# EasyEDA Pro project ProPrj_3x3motorFPGA_2025-06-28.epro, schematic 3x_motor_driver
Board Name: Board1; Create Date: 2025-06-04; Page Name: P1; Project Name: 3x3motorFPGA; Schematic Name: 3x_motor_driver; Update Date: 2025-06-21; Company: EasyEDA.com; Page Size: A4; Version: V2.0
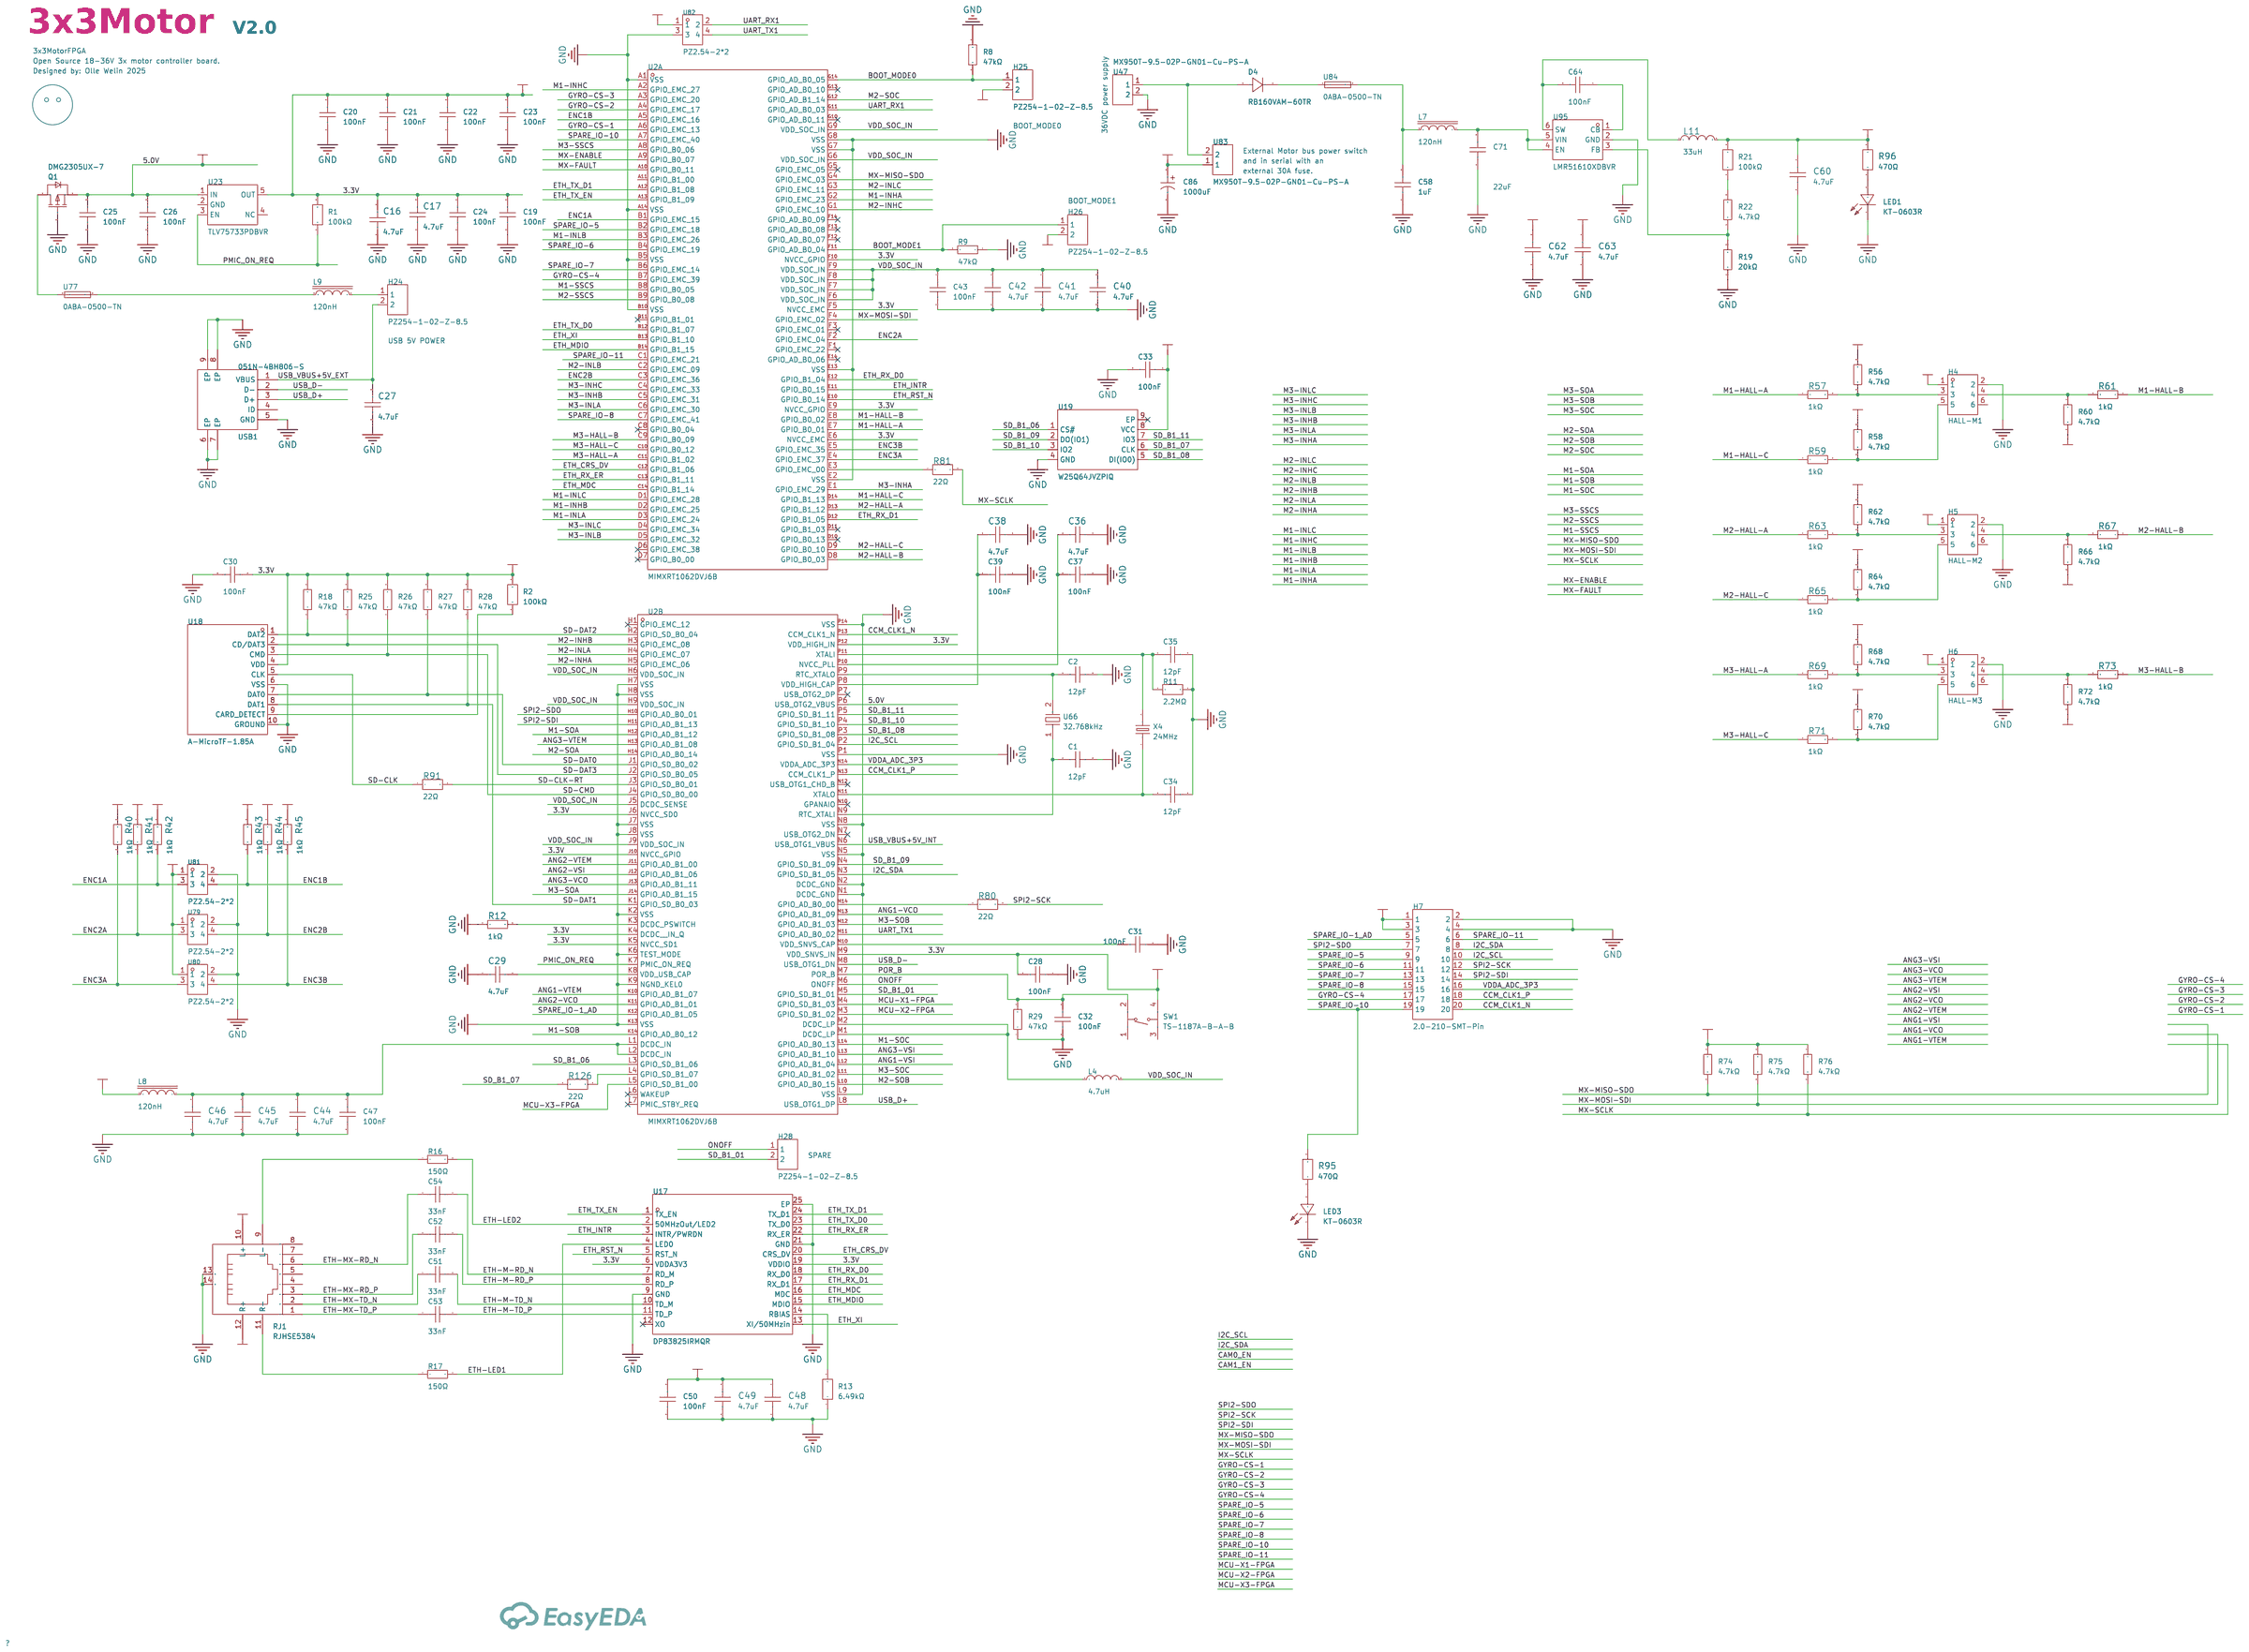
[diagram p0: schematic sheet]

## Parts
C1  12pF  [C0402]
C2  12pF  [C0402]
C16  4.7uF  [C0402]
C17  4.7uF  [C0402]
C19  100nF  [C0402]
C20  100nF  [C0402]
C21  100nF  [C0402]
C22  100nF  [C0402]
C23  100nF  [C0402]
C24  100nF  [C0402]
C25  100nF  [C0402]
C26  100nF  [C0402]
C27  4.7uF  [C0402]
C28  100nF  [C0402]
C29  4.7uF  [C0402]
C30  100nF  [C0402]
C31  100nF  [C0402]
C32  100nF  [C0402]
C33  100nF  [C0402]
C34  12pF  [C0402]
C35  12pF  [C0402]
C36  4.7uF  [C0402]
C37  100nF  [C0402]
C38  4.7uF  [C0402]
C39  100nF  [C0402]
C40  4.7uF  [C0402]
C41  4.7uF  [C0402]
C42  4.7uF  [C0402]
C43  100nF  [C0402]
C44  4.7uF  [C0402]
C45  4.7uF  [C0402]
C46  4.7uF  [C0402]
C47  100nF  [C0402]
C48  4.7uF  [C0402]
C49  4.7uF  [C0402]
C50  100nF  [C0402]
C51  33nF  [C0402]
C52  33nF  [C0402]
C53  33nF  [C0402]
C54  33nF  [C0402]
C58  1uF  [C1206]
C60  4.7uF  [C0402]
C62  4.7uF  [C0402]
C63  4.7uF  [C0402]
C64  100nF  [C0402]
C71  22uF  [C2220]
C86  1000uF  [CAP-TH_BD13.0-P5.00-D0.6-FD]
CBB1  -
CBB2  -
CBB3  -
D4  RB160VAM-60TR  [TUMD2M_L2.0-W1.4-LS2.5-RD]
H4  排母/2.54mm2x3直排母袋装环保  [HDR-TH_6P-P2.54-V-F-R2-C3-S2.54]
H5  排母/2.54mm2x3直排母袋装环保  [HDR-TH_6P-P2.54-V-F-R2-C3-S2.54]
H6  排母/2.54mm2x3直排母袋装环保  [HDR-TH_6P-P2.54-V-F-R2-C3-S2.54]
H7  2.0-210-SMT-Pin  [HDR-TH_20P-P2.00-V-F-R2-C10-S2.00]
H24  PZ254-1-02-Z-8.5  [HDR-TH_2P-P2.54-V-M]
H25  PZ254-1-02-Z-8.5  [HDR-TH_2P-P2.54-V-M]
H26  PZ254-1-02-Z-8.5  [HDR-TH_2P-P2.54-V-M]
H28  PZ254-1-02-Z-8.5  [HDR-TH_2P-P2.54-V-M]
L4  4.7uH  [IND-SMD_L4.0-W4.0]
L7  120nH  [IND-SMD_L2.9-W2.5]
L8  120nH  [IND-SMD_L2.9-W2.5]
L9  120nH  [IND-SMD_L2.9-W2.5]
L11  33uH  [IND-SMD_L8.0-W8.0]
LED1  KT-0603R  [LED0603-RD]
LED3  KT-0603R  [LED0603-RD]
Q1  DMG2305UX-7  [SOT-23-3_L2.9-W1.3-P1.90-LS2.4-BR]
R1  100kΩ  [R0402]
R2  100kΩ  [R0402]
R8  47kΩ  [R0402]
R9  47kΩ  [R0402]
R11  2.2MΩ  [R0402]
R12  1kΩ  [R0402]
R13  6.49kΩ  [R0402]
R16  150Ω  [R0402]
R17  150Ω  [R0402]
R18  47kΩ  [R0402]
R19  20kΩ  [R0402]
R21  100kΩ  [R0402]
R22  4.7kΩ  [R0402]
R25  47kΩ  [R0402]
R26  47kΩ  [R0402]
R27  47kΩ  [R0402]
R28  47kΩ  [R0402]
R29  47kΩ  [R0402]
R40  1kΩ  [R0402]
R41  1kΩ  [R0402]
R42  1kΩ  [R0402]
R43  1kΩ  [R0402]
R44  1kΩ  [R0402]
R45  1kΩ  [R0402]
R56  4.7kΩ  [R0402]
R57  1kΩ  [R0402]
R58  4.7kΩ  [R0402]
R59  1kΩ  [R0402]
R60  4.7kΩ  [R0402]
R61  1kΩ  [R0402]
R62  4.7kΩ  [R0402]
R63  1kΩ  [R0402]
R64  4.7kΩ  [R0402]
R65  1kΩ  [R0402]
R66  4.7kΩ  [R0402]
R67  1kΩ  [R0402]
R68  4.7kΩ  [R0402]
R69  1kΩ  [R0402]
R70  4.7kΩ  [R0402]
R71  1kΩ  [R0402]
R72  4.7kΩ  [R0402]
R73  1kΩ  [R0402]
R74  4.7kΩ  [R0402]
R75  4.7kΩ  [R0402]
R76  4.7kΩ  [R0402]
R80  22Ω  [R0402]
R81  22Ω  [R0402]
R91  22Ω  [R0402]
R95  470Ω  [R0402]
R96  470Ω  [R0402]
R126  22Ω  [R0402]
RJ1  RJHSE5384  [RJ45-TH_RJHSE5384]
SW1  TS-1187A-B-A-B  [SW-SMD_4P-L5.1-W5.1-P3.70-LS6.5-TL_H1.5]
U2  MIMXRT1062DVJ6B  [LFBGA-196_L12.0-W12.0-R14-C14-P0.80-BL]  (sections 1,2)
U17  DP83825IRMQR  [HVQFN-24_L3.0-W3.0-P0.40-TL-EP1.9]
U18  A-MicroTF-1.85A  [TF-SMD_A-MICROTF-1.85A]
U19  W25Q64JVZPIQ  [WSON-8_L6.0-W5.0-P1.27-BL-EP]
U23  TLV75733PDBVR  [SOT-23-5_L2.9-W1.6-P0.95-LS2.8-BL]
U47  MX950T-9.5-02P-GN01-Cu-PS-A  [CONN-TH_2P-P9.50_DB910-9.52-2P]
U66  32.768kHz  [CRYSTAL-SMD_L3.2-W1.5-2]
U77  0ABA-0500-TN  [F0402]
U79  PZ2.54-2*2  [HDR-TH_4P-P2.54-V-M-R2-C2-S2.54]
U80  PZ2.54-2*2  [HDR-TH_4P-P2.54-V-M-R2-C2-S2.54]
U81  PZ2.54-2*2  [HDR-TH_4P-P2.54-V-M-R2-C2-S2.54]
U82  PZ2.54-2*2  [HDR-TH_4P-P2.54-V-M-R2-C2-S2.54]
U83  MX950T-9.5-02P-GN01-Cu-PS-A  [CONN-TH_2P-P9.50_DB910-9.52-2P]
U84  0ABA-0500-TN  [F0402]
U95  LMR51610XDBVR  [SOT-23-6_L2.9-W1.6-P0.95-LS2.8-BR]
USB1  051N-4BH806-S  [MICRO-USB-SMD_051N-4BH806-S]
X4  24MHz  [OSC-SMD_L5.0-W3.2]

## Library data of the parts
C1 C2 C34 C35 = V120J0402HQC500NBT: Capacitance:12pF Voltage Rating:50V Temperature Coefficient:C0G; LCSC Part Name: ±5pF 12pF 50V; Supplier Part: C5251212; Manufacturer: VIIYONG(微容); Supplier Footprint: 0402; JLCPCB Part Class: Extended Part; Datasheet: https://atta.szlcsc.com/upload/public/pdf/source/20210621/C2841456_D184B2C3CE76695828CADF567D00C122.pdf; Supplier: LCSC; Voltage Rating: 50V; Temperature Coefficient: C0G; Check: true
C16 C17 C27 C29 C36 C38 C40-C42 C44-C46 C48 C49 C60 C62 C63 = LMK105BBJ475MVLF: Capacitance: Tolerance:±20% Tolerance:±20% Voltage Rated: Temperature Coefficient:; LCSC Part Name: 4.7uF ±20% 10V; Supplier Part: C386043; Manufacturer: TAIYO YUDEN(太诱); Supplier Footprint: 0402; JLCPCB Part Class: Extended Part; Datasheet: https://atta.szlcsc.com/upload/public/pdf/source/20210525/C2802164_C0429B055888A674C3F00BA74B841C5B.pdf; Supplier: LCSC; Tolerance: ±20%; Check: true
C19-C26 C28 C30-C33 C37 C39 C43 C47 C50 C64 = CL05B104KB54PNC: Capacitance: Tolerance:±10% Tolerance:±10% Voltage Rated: Temperature Coefficient:; LCSC Part Name: 100nF ±10% 50V; Supplier Part: C307331; Manufacturer: SAMSUNG(三星); Supplier Footprint: 0402; JLCPCB Part Class: Basic Part; Datasheet: https://atta.szlcsc.com/upload/public/pdf/source/20160218/1457707763339.pdf; Supplier: LCSC; Tolerance: ±10%; Check: true
C51-C54 = 0402B333K160CT: Capacitance: Tolerance:±10% Tolerance:±10% Voltage Rated: Temperature Coefficient:; LCSC Part Name: 33nF ±10% 16V; Supplier Part: C301939; Manufacturer: Walsin(华新科); Supplier Footprint: 0402; JLCPCB Part Class: Extended Part; Datasheet: https://atta.szlcsc.com/upload/public/pdf/source/20191217/C469650_84AD5C6F618CF4AC0C6D987F2E8FE6F8.pdf; Supplier: LCSC; Tolerance: ±10%; Check: true
C58 = CL31B105KBHNNNE: Capacitance: Tolerance:±10% Tolerance:±10% Voltage Rated: Temperature Coefficient:; LCSC Part Name: 1uF ±10% 50V; Supplier Part: C1848; Manufacturer: SAMSUNG(三星); Supplier Footprint: 1206; JLCPCB Part Class: Basic Part; Datasheet: https://atta.szlcsc.com/upload/public/pdf/source/20160218/1457707763339.pdf; Supplier: LCSC; Tolerance: ±10%; Check: true
C71 = FS55X226K500EHG: Capacitance:22uF Tolerance:±10% Tolerance:±10% Voltage Rating:50V Temperature Coefficient:X7R; LCSC Part Name: 22uF ±10% 50V; Supplier Part: C784103; Manufacturer: PSA(信昌电陶); Supplier Footprint: 2220; JLCPCB Part Class: Extended Part; Datasheet: https://atta.szlcsc.com/upload/public/pdf/source/20190723/C381466_B1CCDB289216E7EE775C98769E222CFD.pdf; Supplier: LCSC; Tolerance: ±10%; Voltage Rating: 50V; Temperature Coefficient: X7R; Check: true
C86 = 50V1000uF CD288: Capacitance: Tolerance:±20% Tolerance:±20% Rated Voltage: Ripple Current:- Equivalent Series Resistance(ESR):- Lead Spacing: φD: L: Lifetime @ Temp:- Operating Temperature:-40℃~+105℃ Operating Temperature:-40℃~+105℃; LCSC Part Name: 1000uF ±20% 50V; Supplier Part: C2960425; Manufacturer: HRK(鸿瑞凯电子); Supplier Footprint: 插件,D13xL26mm; JLCPCB Part Class: Extended Part; Datasheet: https://atta.szlcsc.com/upload/public/pdf/source/20220228/DED310EF63E6FF368A764400E9E39D2D.pdf; Supplier: LCSC; Tolerance: ±20%; Operating Temperature: -40℃~+105℃
D4 = RB160VAM-60TR: Diode Configuration:Independent Type Voltage - Forward(Vf@If):610mV@1A Voltage - DC Reverse(Vr):60V Current - Rectified:1A Reverse Leakage Current (Ir):40uA@60V; LCSC Part Name: 电压:60V 电流:1A; Supplier Part: C600653; Manufacturer: ROHM(罗姆); Supplier Footprint: SOD-323HE; JLCPCB Part Class: Extended Part; Datasheet: https://atta.szlcsc.com/upload/public/pdf/source/20210312/C600653_2327DECE823B494B59F4354F32032AFC.pdf; Supplier: LCSC; Diode Configuration: Independent Type; Voltage - Forward(Vf@If): 610mV@1A; Voltage - DC Reverse(Vr): 60V; Current - Rectified: 1A; Reverse Leakage Current (Ir): 40uA@60V
H4-H6 = 排母/2.54mm2x3直排母袋装环保: Circluar Pins/Square Pins:- Current Rating (Max):- Voltage Rating (Max):- Length of Mating Pin:- Insulation Height:- Contact Material:; LCSC Part Name: 2.54mm 2x3 直排母 袋装 环保; Supplier Part: C47552; Supplier Footprint: 2.54mm2x3; JLCPCB Part Class: Extended Part; Supplier: LCSC
H7 = 2.0-210-SMT-Pin: Supplier Part: C9900188734; Supplier Footprint: TH_2X10P; JLCPCB Part Class: Extended Part; Supplier: LCSC
H24-H26 H28 = PZ254-1-02-Z-8.5_C2894925: Pin Structure:1x2P Pitch:2.54mm Row Spacing:- Circluar Pins/Square Pins:Policy Mounting Type:Straight Number of Rows:Single Row Number of Pins:2P Current Rating:3A Voltage Rating (Max):- Length of Mating Pin:6mm Insulation Height:2.5mm Length of End Conne; LCSC Part Name: 1x2P 间距:2.54mm 方针 直插; Supplier Part: C2894925; Manufacturer: HCTL(华灿天禄); Supplier Footprint: 插件,P=2.54mm; JLCPCB Part Class: Extended Part; Datasheet: https://atta.szlcsc.com/upload/public/pdf/source/20240305/0F0A2A5C422E5D195558C9C26715A031.pdf; Supplier: LCSC; Pin Structure: 1x2P; Pitch: 2.54mm; Circluar Pins/Square Pins: Policy; Mounting Type: Straight; Number of Rows: Single Row; Number of Pins: 2P; Current Rating: 3A; Length of Mating Pin: 6mm; Insulation Height: 2.5mm; Length of End Connection Pin: 3mm; Contact Material: Brass; Operating Temperature: -40℃~+105℃; Color: Black
L4 = SNR4018-4R7MT: Inductance:4.7uH Tolerance:±20% Tolerance:±20% Current - Saturation(Isat):1.7A DC Resistance(DCR):115mΩ Type:Shielded inductor; LCSC Part Name: 4.7uH ±20% 1.7A 温升电流：1.2A; Supplier Part: C5127371; Manufacturer: LanTu Micro(蓝图微电); Supplier Footprint: SMD,4x4mm; JLCPCB Part Class: Extended Part; Datasheet: https://atta.szlcsc.com/upload/public/pdf/source/20220824/1D4634DBF555B7A8AAFB4C498854329B.pdf; Supplier: LCSC; Tolerance: ±20%; Current - Saturation(Isat): 1.7A; DC Resistance(DCR): 115mΩ; Type: Shielded inductor; Check: true
L7-L9 = LSF1008-R12J-T: Inductance: Tolerance:±5% Tolerance:±5% Rated Current: DC Resistance (DCR):; LCSC Part Name: 120nH ±5%; Supplier Part: C252036; Manufacturer: EMTEK(兆欣); Supplier Footprint: 1008; JLCPCB Part Class: Extended Part; Datasheet: https://atta.szlcsc.com/upload/public/pdf/source/20180820/C252039_93C7C0847C63F47FE7E3FF4F1F6863C7.pdf; Supplier: LCSC; Tolerance: ±5%
L11 = NRS8030T330MJGJ: Inductance: Tolerance:±20% Tolerance:±20% Rated Current: Saturation Current (Isat):1.3A DC Resistance (DCR): Type:- Ratings:-; LCSC Part Name: 33uH ±20% 1.3A; Supplier Part: C223028; Manufacturer: TAIYO YUDEN(太诱); Supplier Footprint: SMD; JLCPCB Part Class: Extended Part; Datasheet: https://atta.szlcsc.com/upload/public/pdf/source/20190109/C223107_6890E0091A0A1C9F55D0D2B3B6121437.pdf; Supplier: LCSC; Tolerance: ±20%; Saturation Current (Isat): 1.3A
LED1 LED3 = KT-0603R: Emitted Color:Red Power Dissipation:- Forward Current:- Dominant Wavelength:- Dominant Wavelength:- Peak Wavelength:- Diode Configuration:- Lens Color:- Color Temperature:- Color Temperature:- Viewing Angle:- Mounting Sytle:- Operating Temperature:-40℃~+8; LCSC Part Name: 0603 红灯 高亮; Supplier Part: C2286; Manufacturer: KENTO; Supplier Footprint: 0603; JLCPCB Part Class: Basic Part; Datasheet: https://atta.szlcsc.com/upload/public/pdf/source/20160616/1466072038404.pdf; Supplier: LCSC; Emitted Color: Red; Operating Temperature: -40℃~+85℃
Q1 = DMG2305UX-7_C5261054: Type:1 piece P-channel Drain to Source Voltage:20V Current - Continuous Drain(Id):5A RDS(on):45mΩ@4.5V,3.4A Pd - Power Dissipation:1.31W Gate Threshold Voltage (Vgs(th)@Id):400mV Gate Charge(Qg):14.3nC@4.5V Input Capacitance(Ciss@Vds):1.2nF@15V Reverse Tr; LCSC Part Name: 1个P沟道 耐压:20V 电流:5A; Supplier Part: C5261054; Manufacturer: HXY MOSFET(华轩阳电子); Supplier Footprint: SOT-23; JLCPCB Part Class: Extended Part; Datasheet: https://atta.szlcsc.com/upload/public/pdf/source/20221111/024C642DF6D3CB691005FFB8AA66D2BE.pdf; Supplier: LCSC; Type: 1 piece P-channel; Drain to Source Voltage: 20V; Current - Continuous Drain(Id): 5A; RDS(on): 45mΩ@4.5V,3.4A; Pd - Power Dissipation: 1.31W; Gate Threshold Voltage (Vgs(th)@Id): 400mV; Gate Charge(Qg): 14.3nC@4.5V; Input Capacitance(Ciss@Vds): 1.2nF@15V; Reverse Transfer Capacitance (Crss@Vds): 151pF@15V; Operating Temperature: -55℃~+150℃; Check: true
R1 R2 R21 = FRC0402F1003TS: Type:Thick Film Resistors Resistance:100kΩ Tolerance:±1% Tolerance:±1% Power(Watts): Overload Voltage (Max): Temperature Coefficient:±100ppm/℃ Temperature Coefficient:±100ppm/℃ Operating Temperature Range:-55℃~+155℃ Operating Temperature Range:-55℃~+155℃; LCSC Part Name: 100kΩ ±1% 62.5mW 厚膜电阻; Supplier Part: C2906859; Manufacturer: FOJAN(富捷); Supplier Footprint: 0402; JLCPCB Part Class: Extended Part; Datasheet: https://atta.szlcsc.com/upload/public/pdf/source/20211221/925EC7D7225764EE0046F22065062C87.pdf; Supplier: LCSC; Type: Thick Film Resistors; Tolerance: ±1%; Temperature Coefficient: ±100ppm/℃; Operating Temperature Range: -55℃~+155℃; Check: true
R8 R9 R18 R25-R29 = AC0402JR-0747KL: Type:Thick Film Resistors Resistance: Tolerance:±5% Tolerance:±5% Power(Watts): Overload Voltage (Max): Temperature Coefficient:±100ppm/℃ Temperature Coefficient:±100ppm/℃ Operating Temperature Range:-55℃~+155℃ Operating Temperature Range:-55℃~+155℃; LCSC Part Name: 厚膜电阻 47kΩ ±5% 62.5mW; Supplier Part: C144710; Manufacturer: YAGEO(国巨); Supplier Footprint: 0402; JLCPCB Part Class: Extended Part; Datasheet: https://atta.szlcsc.com/upload/public/pdf/source/20180927/C229861_4ABDC471507C1ED6AFB4BA66AFC8620A.pdf; Supplier: LCSC; Type: Thick Film Resistors; Tolerance: ±5%; Temperature Coefficient: ±100ppm/℃; Operating Temperature Range: -55℃~+155℃; Check: true
R11 = FRC0402F2204TS: Type:Thick Film Resistors Resistance:2.2MΩ Tolerance:±1% Tolerance:±1% Power(Watts):1/16W Voltage-Supply(Max):50V Temperature Coefficient:±100ppm/℃ Temperature Coefficient:±100ppm/℃ Operating Temperature:-55℃~+155℃ Operating Temperature:-55℃~+155℃; LCSC Part Name: 2.2MΩ ±1% 62.5mW 厚膜电阻; Supplier Part: C2998080; Manufacturer: FOJAN(富捷); Supplier Footprint: 0402; JLCPCB Part Class: Extended Part; Datasheet: https://atta.szlcsc.com/upload/public/pdf/source/20211221/925EC7D7225764EE0046F22065062C87.pdf; Supplier: LCSC; Type: Thick Film Resistors; Tolerance: ±1%; Power(Watts): 1/16W; Voltage-Supply(Max): 50V; Temperature Coefficient: ±100ppm/℃; Operating Temperature: -55℃~+155℃; Check: true
R12 R40-R45 R57 R59 R61 R63 R65 R67 R69 R71 R73 = 0402WGF1001TCE: Type:Thick Film Resistors Resistance:1kΩ Tolerance:±1% Tolerance:±1% Power(Watts): Overload Voltage (Max): Temperature Coefficient:±100ppm/℃ Temperature Coefficient:±100ppm/℃ Operating Temperature Range:-55℃~+155℃ Operating Temperature Range:-55℃~+155℃; LCSC Part Name: 1kΩ ±1% 62.5mW 厚膜电阻; Supplier Part: C11702; Manufacturer: UNI-ROYAL(厚声); Supplier Footprint: 0402; JLCPCB Part Class: Basic Part; Datasheet: https://atta.szlcsc.com/upload/public/pdf/source/20200306/C422600_1E6D84923E4A46A82E41ADD87F860B5C.pdf; Supplier: LCSC; Type: Thick Film Resistors; Tolerance: ±1%; Temperature Coefficient: ±100ppm/℃; Operating Temperature Range: -55℃~+155℃; Check: true
R13 = RT0402BRE076K49L: Type:Thin Film Resistor Resistance: Tolerance:±0.1% Tolerance:±0.1% Power(Watts): Temperature Coefficient:±50ppm/℃ Temperature Coefficient:±50ppm/℃ Operating Temperature Range:-55℃~+155℃ Operating Temperature Range:-55℃~+155℃; LCSC Part Name: 薄膜电阻 6.49kΩ ±0.1% 62.5mW; Supplier Part: C853380; Manufacturer: YAGEO(国巨); Supplier Footprint: 0402; JLCPCB Part Class: Extended Part; Datasheet: https://atta.szlcsc.com/upload/public/pdf/source/20200610/C326738_5639A9F1B6EB6E4AE2197577D3456E7F.pdf; Supplier: LCSC; Type: Thin Film Resistor; Tolerance: ±0.1%; Temperature Coefficient: ±50ppm/℃; Operating Temperature Range: -55℃~+155℃; Check: true
R16 R17 = 0402WGF1500TCE: Type:Thick Film Resistors Resistance: Tolerance:±1% Tolerance:±1% Power(Watts): Overload Voltage (Max): Temperature Coefficient:±100ppm/℃ Temperature Coefficient:±100ppm/℃ Operating Temperature Range:-55℃~+155℃ Operating Temperature Range:-55℃~+155℃; LCSC Part Name: 150Ω ±1% 62.5mW 厚膜电阻; Supplier Part: C25082; Manufacturer: UNI-ROYAL(厚声); Supplier Footprint: 0402; JLCPCB Part Class: Extended Part; Datasheet: https://atta.szlcsc.com/upload/public/pdf/source/20200306/C422600_1E6D84923E4A46A82E41ADD87F860B5C.pdf; Supplier: LCSC; Type: Thick Film Resistors; Tolerance: ±1%; Temperature Coefficient: ±100ppm/℃; Operating Temperature Range: -55℃~+155℃; Check: true
R19 = 0402WGJ0203TCE: Type:Thick Film Resistors Resistance:20kΩ Tolerance:±5% Tolerance:±5% Power(Watts): Overload Voltage (Max): Temperature Coefficient:±100ppm/℃ Temperature Coefficient:±100ppm/℃ Operating Temperature Range:-55℃~+155℃ Operating Temperature Range:-55℃~+155℃; LCSC Part Name: 20kΩ ±5% 62.5mW 厚膜电阻; Supplier Part: C25545; Manufacturer: UNI-ROYAL(厚声); Supplier Footprint: 0402; JLCPCB Part Class: Extended Part; Datasheet: https://atta.szlcsc.com/upload/public/pdf/source/20200306/C422600_1E6D84923E4A46A82E41ADD87F860B5C.pdf; Supplier: LCSC; Type: Thick Film Resistors; Tolerance: ±5%; Temperature Coefficient: ±100ppm/℃; Operating Temperature Range: -55℃~+155℃; Check: true
R22 R56 R58 R60 R62 R64 R66 R68 R70 R72 R74-R76 = 0402WGF4701TCE: Type:Thick Film Resistors Resistance:4.7kΩ Tolerance:±1% Tolerance:±1% Power(Watts): Overload Voltage (Max): Temperature Coefficient:±100ppm/℃ Temperature Coefficient:±100ppm/℃ Operating Temperature Range:-55℃~+155℃ Operating Temperature Range:-55℃~+155℃; LCSC Part Name: 4.7kΩ ±1% 62.5mW 厚膜电阻; Supplier Part: C25900; Manufacturer: UNI-ROYAL(厚声); Supplier Footprint: 0402; JLCPCB Part Class: Basic Part; Datasheet: https://atta.szlcsc.com/upload/public/pdf/source/20200306/C422600_1E6D84923E4A46A82E41ADD87F860B5C.pdf; Supplier: LCSC; Type: Thick Film Resistors; Tolerance: ±1%; Temperature Coefficient: ±100ppm/℃; Operating Temperature Range: -55℃~+155℃
R80 R81 R91 R126 = ERJU02J220X: Type:Thick Film Resistors Resistance: Tolerance:±5% Tolerance:±5% Power(Watts): Overload Voltage (Max):- Temperature Coefficient:±200ppm/℃ Temperature Coefficient:±200ppm/℃ Operating Temperature Range:-55℃~+155℃ Operating Temperature Range:-55℃~+155℃; LCSC Part Name: 22Ω ±5% 100mW 厚膜电阻; Supplier Part: C417075; Manufacturer: PANASONIC(松下); Supplier Footprint: 0402; JLCPCB Part Class: Extended Part; Datasheet: https://atta.szlcsc.com/upload/public/pdf/source/20190902/C417075_4E42CA60D5BEE932868E62293D93DA2D.pdf; Supplier: LCSC; Type: Thick Film Resistors; Tolerance: ±5%; Temperature Coefficient: ±200ppm/℃; Operating Temperature Range: -55℃~+155℃
R95 R96 = 0402WGF4700TCE: Type:Thick Film Resistors Resistance: Tolerance:±1% Tolerance:±1% Power(Watts): Overload Voltage (Max): Temperature Coefficient:±100ppm/℃ Temperature Coefficient:±100ppm/℃ Operating Temperature Range:-55℃~+155℃ Operating Temperature Range:-55℃~+155℃; LCSC Part Name: 470Ω ±1% 62.5mW 厚膜电阻; Supplier Part: C25117; Manufacturer: UNI-ROYAL(厚声); Supplier Footprint: 0402; JLCPCB Part Class: Basic Part; Datasheet: https://atta.szlcsc.com/upload/public/pdf/source/20200306/C422600_1E6D84923E4A46A82E41ADD87F860B5C.pdf; Supplier: LCSC; Type: Thick Film Resistors; Tolerance: ±1%; Temperature Coefficient: ±100ppm/℃; Operating Temperature Range: -55℃~+155℃
RJ1 = RJHSE5384: Connector Type:RJ45Receptacle Number of Ports:1 Mounting Style:Right-Angle Shielding:有屏蔽 LED:WithLED Ratings:- Contact Material:Phosphor bronze Contact Plating:Gold Operating Temperature Range:-55℃~+85℃ Operating Temperature Range:-55℃~+85℃; LCSC Part Name: 弯插 带LED; Supplier Part: C464587; Manufacturer: Amphenol; Supplier Footprint: 插件; JLCPCB Part Class: Extended Part; Datasheet: https://atta.szlcsc.com/upload/public/pdf/source/20200113/C464587_DA37165506181FE3475508D68C93AFC6.pdf; Supplier: LCSC; Connector Type: RJ45Receptacle; Number of Ports: 1; Mounting Style: Right-Angle; Shielding: 有屏蔽; LED: WithLED; Contact Material: Phosphor bronze; Contact Plating: Gold; Operating Temperature Range: -55℃~+85℃
SW1 = TS-1187A-B-A-B: Circuit:SPST Actuator Style:Round Button Operating Force:160gf Mounting Style:Brick nogging Switch Length:5.1mm Switch Width:5.1mm Switch Height:1.5mm Strike Gundam:不带 Contact Current:50mA Voltage Rating (DC):12V Insulation Resistance:- Actuator/Cap Color; LCSC Part Name: 5.1*5.1*1.5mm 立贴 轻触开关; Supplier Part: C318884; Manufacturer: XKB Connectivity(中国星坤); Supplier Footprint: SMD; JLCPCB Part Class: Basic Part; Datasheet: https://atta.szlcsc.com/upload/public/pdf/source/20200227/C318890_053E50208A88A7BA1965D8746000774E.pdf; Supplier: LCSC; Circuit: SPST; Actuator Style: Round Button; Operating Force: 160gf; Mounting Style: Brick nogging; Switch Length: 5.1mm; Switch Width: 5.1mm; Switch Height: 1.5mm; Strike Gundam: 不带; Contact Current: 50mA; Voltage Rating (DC): 12V; Actuator/Cap Color: 金色; With Lamp: No; Mechanical Life: 10万次; Operating Temperature: -30℃~+85℃; Check: true
U2 = MIMXRT1062DVJ6B: CPU Core:- GPIO Ports Number:127 Operating Voltage Range:3V~3.6V Operating Voltage Range:3V~3.6V CPU Maximum Speed:600MHz Operating Temperature Range:0℃~+95℃ Operating Temperature Range:0℃~+95℃ ADC (Bit):12bit Universal Serial Bus:Yes Watchdog:Yes Low-Vol; Supplier Part: C3216699; Manufacturer: NXP(恩智浦); Supplier Footprint: LFBGA-196; JLCPCB Part Class: Extended Part; Datasheet: https://www.nxp.com.cn/docs/en/data-sheet/IMXRT1060XXEC.pdf; Supplier: LCSC; GPIO Ports Number: 127; Operating Voltage Range: 3V~3.6V; CPU Maximum Speed: 600MHz; Operating Temperature Range: 0℃~+95℃; ADC (Bit): 12bit; Universal Serial Bus: Yes; Watchdog: Yes; Low-Voltage Detect: Yes; Secure Digital Input and Output: Yes; Direct Memory Access: Yes
U17 = DP83825IRMQR: Application Function: Number of Channels: Interface: Supply Voltage:1.8V；3.3V Supply Voltage:1.8V；3.3V Supply Current:15.5mA Operating Temperature:-40℃~+85℃ Operating Temperature:-40℃~+85℃; LCSC Part Name: DP83825I低功耗10/100Mbps以太网物理层收发器; Supplier Part: C783599; Manufacturer: TI(德州仪器); Supplier Footprint: HVQFN-24-EP(3x3); JLCPCB Part Class: Extended Part; Datasheet: https://www.ti.com/cn/lit/gpn/dp83825i; Supplier: LCSC; Supply Voltage: 1.8V；3.3V; Supply Current: 15.5mA; Operating Temperature: -40℃~+85℃; Check: true
U18 = A-MicroTF-1.85A: Card Connection Mode:Self-bouncing Card Type:MicroSD card (TF card) Connector Type:Card Slot Additional Card Detection Pins:- Supplementary Features:- Maximum Body Height:1.85mm Operating Temperature Range:-25℃~+85℃ Operating Temperature Range:-25℃~+85℃; LCSC Part Name: 自弹式 MicroSD卡(TF卡) 卡座; Supplier Part: C22467599; Manufacturer: MyAntenna(摩天射频); Supplier Footprint: SMD; JLCPCB Part Class: Extended Part; Datasheet: https://atta.szlcsc.com/upload/public/pdf/source/20240625/953FC7A55E22CF141735372468CF4E69.pdf; Supplier: LCSC; Card Connection Mode: Self-bouncing; Card Type: MicroSD card (TF card); Connector Type: Card Slot; Maximum Body Height: 1.85mm; Operating Temperature Range: -25℃~+85℃; Check: true
U19 = W25Q64JVZPIQ: Interface Type:SPI Memory Size:64Mbit Clock Frequency (fc):133MHz Supply Voltage:2.7V~3.6V Supply Voltage:2.7V~3.6V Page Programming Time (Tpp):400us Block Erase Time (tBE):120ms@(32KB) Data Retention - TDR (Year):20 years Operating Temperature:-40℃~+85℃; Supplier Part: C2940197; Manufacturer: WINBOND(华邦); Supplier Footprint: WSON-8-EP(5x6); JLCPCB Part Class: Extended Part; Datasheet: https://atta.szlcsc.com/upload/public/pdf/source/20220111/96C134BA110DAC08742B3CB6C4519B4C.pdf; Supplier: LCSC; Interface Type: SPI; Memory Size: 64Mbit; Clock Frequency (fc): 133MHz; Supply Voltage: 2.7V~3.6V; Page Programming Time (Tpp): 400us; Block Erase Time (tBE): 120ms@(32KB); Data Retention - TDR (Year): 20 years; Operating Temperature: -40℃~+85℃; Check: true
U23 = TLV75733PDBVR: Output Type:Fixed Maximum Input Voltage:5.5V Output Voltage:3.3V Output Voltage:3.3V Output Current:1A Power Supply Rejection Ratio (PSRR):52dB Dropout Voltage:475mV@(1A) Feature:ESD Protection；Surge Protection；Low ESR；Thermal Protection(TSD)；Under-voltag; LCSC Part Name: 具有使能功能的 1A、低 IQ、高精度、低压降稳压器; Supplier Part: C485517; Manufacturer: TI(德州仪器); Supplier Footprint: SOT-23-5; JLCPCB Part Class: Extended Part; Datasheet: https://www.ti.com/cn/lit/gpn/tlv757p; Supplier: LCSC; Output Type: Fixed; Maximum Input Voltage: 5.5V; Output Voltage: 3.3V; Output Current: 1A; Power Supply Rejection Ratio (PSRR): 52dB; Dropout Voltage: 475mV@(1A); Feature: ESD Protection；Surge Protection；Low ESR；Thermal Protection(TSD)；Under-voltage Lockout；Overcurrent Protection(OCP)；With ability; Operating Temperature: -40℃~+125℃@(Tj); Output Polarity: Positive electrode; Number of Outputs: 1; Check: true
U47 U83 = MX950T-9.5-02P-GN01-Cu-PS-A: Number of Positions or Pins:1x2P Pitch:9.5mm Color:Green Mounting Type:Direct Insert Number of Pins:2P Number of Rows:1 Number of PINs Per Row:2 Screw Specification:M3 Current Rating:30A Voltage Rating (Max):300V Wire Gauge - AWG:10~26 Wire Gauge - AWG:10; LCSC Part Name: 1x2P 9.5mm 直插 排数:1 每排P数:2; Supplier Part: C5188495; Manufacturer: MAX(迈旭); Supplier Footprint: 插件,P=9.5mm; JLCPCB Part Class: Extended Part; Datasheet: https://atta.szlcsc.com/upload/public/pdf/source/20230914/A46700B75FD416133173DB44AA766FB2.pdf; Supplier: LCSC; Number of Positions or Pins: 1x2P; Pitch: 9.5mm; Color: Green; Mounting Type: Direct Insert; Number of Pins: 2P; Number of Rows: 1; Number of PINs Per Row: 2; Screw Specification: M3; Current Rating: 30A; Voltage Rating (Max): 300V; Wire Gauge - AWG: 10~26; Wire Gauge - mm2: 4; Operating Temperature: -40℃~+105℃; Check: true
U66 = H3100327092070CY: Crystal Type:- Frequency: Normal temperature Frequency Tolerance:±20ppm Normal temperature Frequency Tolerance:±20ppm External load capacitor: Frequency Stability(Full temperature range):- Frequency Stability(Full temperature range):- Equivalent Series Re; LCSC Part Name: 32.768kHz ±20ppm 9pF; Supplier Part: C20625736; Manufacturer: JGHC(晶光华); Supplier Footprint: SMD3215-2P; JLCPCB Part Class: Extended Part; Datasheet: https://atta.szlcsc.com/upload/public/pdf/source/20240227/1BA8F2B3CA37474D46EE46FE051746E1.pdf; Supplier: LCSC; Normal temperature Frequency Tolerance: ±20ppm; Equivalent Series Resistance (ESR): 70kΩ; Check: true
U77 U84 = 0ABA-0500-TN: Type:- Current Rating:500mA Voltage Rating (DC):32V Operating Temperature:-55℃~+125℃ Operating Temperature:-55℃~+125℃ Breaking Capacity:35A; Supplier Part: C3162379; Manufacturer: belfuse; Supplier Footprint: 0402; JLCPCB Part Class: Extended Part; Datasheet: https://atta.szlcsc.com/upload/public/pdf/source/20240129/EFB68109F57EF58AE31C262C6E681BC9.pdf; Supplier: LCSC; Current Rating: 500mA; Voltage Rating (DC): 32V; Operating Temperature: -55℃~+125℃; Breaking Capacity: 35A
U79-U82 = PZ2.54-2*2: Pin Structure:2x2P Pitch:2.54mm Number of Rows:双排 Number of Pins:4P; Supplier Part: C5156675; Manufacturer: ZHOURI(洲日); Supplier Footprint: 插件,P=2.54mm; JLCPCB Part Class: Extended Part; Datasheet: https://atta.szlcsc.com/upload/public/pdf/source/20220923/B99F04FBBE53F9D60C18D50D8418B40E.pdf; Supplier: LCSC; Pin Structure: 2x2P; Pitch: 2.54mm; Number of Rows: 双排; Number of Pins: 4P
U95 = LMR51610XDBVR: Function:Step-down type Output Type:Adjustable Input Voltage:4V~65V Input Voltage:4V~65V Output Voltage:- Output Voltage:- Output Current:1A Switching Frequency:400kHz~1.1MHz Switching Frequency:400kHz~1.1MHz Operating Temperature:-40℃~+150℃ Operating Tem; LCSC Part Name: 4V至65V输入范围的1A同步降压转换器; Supplier Part: C20539658; Manufacturer: TI(德州仪器); Supplier Footprint: SOT-23; JLCPCB Part Class: Extended Part; Datasheet: https://atta.szlcsc.com/upload/public/pdf/source/20240112/FA5D53F5D264F9958129C86E08D1F3BB.pdf; Supplier: LCSC; Function: Step-down type; Output Type: Adjustable; Input Voltage: 4V~65V; Output Current: 1A; Switching Frequency: 400kHz~1.1MHz; Operating Temperature: -40℃~+150℃; Synchronous Rectification: Yes; Number of Outputs: 1; Topology: Step-down; Quiescent Current (Iq): 420uA; Switch tube (built-in/external): Built-in
USB1 = 051N-4BH806-S: Supplier Part: C25503148; Manufacturer: HanElectricity(瀚源); Supplier Footprint: SMD; JLCPCB Part Class: Extended Part; Datasheet: https://atta.szlcsc.com/upload/public/pdf/source/20240704/B9ACE647D7515FFB86E3BAE398E1EB22.pdf; Supplier: LCSC; Check: true
X4 = XSHEELNANF-24MHZ: Type:Surface Mount Crystal Frequency:24MHz Normal temperature Frequency Tolerance:±30ppm Normal temperature Frequency Tolerance:±30ppm Load Capacitance:20pF Frequency Stability:±30ppm Frequency Stability:±30ppm Operating Temperature:-40℃~+85℃ Operating Te; LCSC Part Name: 24MHz ±30ppm 20pF; Supplier Part: C295068; Manufacturer: TAITIEN(泰艺电子); Supplier Footprint: SMD5032; JLCPCB Part Class: Extended Part; Datasheet: https://atta.szlcsc.com/upload/public/pdf/source/20181022/C295065_30495E01EBF1E615C4AE562CEB2D9337.pdf; Supplier: LCSC; Type: Surface Mount Crystal; Normal temperature Frequency Tolerance: ±30ppm; Load Capacitance: 20pF; Frequency Stability: ±30ppm; Operating Temperature: -40℃~+85℃

## Nets
3.3V: C16.2 C17.2 C19.2 C20.2 C21.2 C22.2 C23.2 C24.2 C28.2 C30.1 C33.1 C48.1 C49.1 C50.1 H7.1 H7.3 H25.2 H26.2 L8.2 R1.2 R2.2 R18.2 R25.2 R26.2 R27.2 R28.2 R40.1 R41.1 R42.1 R43.1 R44.1 R45.1 R56.2 R58.2 R60.2 R62.2 R64.2 R66.2 R68.2 R70.2 R72.2 R74.1 R75.1 R76.1 RJ1.10(L+) RJ1.12(R+) SW1.4(D) U2.E6(NVCC_EMC) U2.E9(NVCC_GPIO) U2.F5(NVCC_EMC) U2.F10(NVCC_GPIO) U2.J6(NVCC_SD0) U2.J10(NVCC_GPIO) U2.K4(DCDC__IN_Q) U2.K5(NVCC_SD1) U2.M9(VDD_SNVS_IN) U2.P12(VDD_HIGH_IN) U17.6(VDDA3V3) U17.19(VDDIO) U18.4(VDD) U19.8(VCC) U23.5(OUT) U82.1
5.0V: C25.2 C26.2 C60.1 C62.1 C63.1 H4.1 H5.1 H6.1 L11.2 Q1.2(S) R21.2 R96.2 U2.P6(USB_OTG2_VBUS) U23.1(IN) U79.1 U80.1 U81.1
36V: C86.1 U83.1
GND: C1.2 C2.2 C16.1 C17.1 C19.1 C20.1 C21.1 C22.1 C23.1 C24.1 C25.1 C26.1 C27.1 C28.1 C29.1 C30.2 C31.1 C32.2 C33.2 C34.2 C35.2 C36.1 C37.1 C38.1 C39.1 C40.2 C41.2 C42.2 C43.2 C44.2 C45.2 C46.2 C47.2 C48.2 C49.2 C50.2 C58.1 C60.2 C62.2 C63.2 C71.1 C86.2 H4.2 H5.2 H6.2 H7.2 H7.4 LED1.1(K) LED3.1(K) Q1.1(G) R8.2 R9.1 R11.2 R12.1 R13.1 R19.1 R29.1 RJ1.13(SHELL) RJ1.14(SHELL) U2.A1(VSS) U2.A14(VSS) U2.B5(VSS) U2.B10(VSS) U2.E2(VSS) U2.E13(VSS) U2.G7(VSS) U2.G8(VSS) U2.H7(VSS) U2.H8(VSS) U2.J7(VSS) U2.J8(VSS) U2.K2(VSS) U2.K6(TEST_MODE) U2.K9(NGND_KEL0) U2.K13(VSS) U2.L9(VSS) U2.N1(DCDC_GND) U2.N2(DCDC_GND) U2.N5(VSS) U2.N8(VSS) U2.P1(VSS) U2.P14(VSS) U17.9(GND) U17.21(GND) U17.25(EP) U18.6(VSS) U18.10(GROUND) U19.4(GND) U47.2 U79.2 U80.2 U81.2 U82.3 U95.2(GND) USB1.5(GND) USB1.6(EP) USB1.7(EP) USB1.8(EP) USB1.9(EP)
VDD_SOC_IN: C40.1 C41.1 C42.1 C43.1 L4.2 U2.F6(VDD_SOC_IN) U2.F7(VDD_SOC_IN) U2.F8(VDD_SOC_IN) U2.F9(VDD_SOC_IN) U2.G6(VDD_SOC_IN) U2.G9(VDD_SOC_IN) U2.H6(VDD_SOC_IN) U2.H9(VDD_SOC_IN) U2.J5(DCDC_SENSE) U2.J9(VDD_SOC_IN)
VDDA_ADC_3P3: H7.16 U2.N14(VDDA_ADC_3P3)
ANG1-VCO: CBB1.(M1-SSCS) CBB2.(GYRO-CS-4) CBB3.(MCU-X3-FPGA) H7.6 H7.7 H7.8 H7.9 H7.10 H7.11 H7.12 H7.13 H7.14 H7.15 H7.17 H7.19 R74.2 R75.2 R76.2 R80.2 R81.2 R95.2 U2.A2(GPIO_EMC_27) U2.A3(GPIO_EMC_20) U2.A4(GPIO_EMC_17) U2.A6(GPIO_EMC_13) U2.A7(GPIO_EMC_40) U2.A8(GPIO_B0_06) U2.A9(GPIO_B0_07) U2.A10(GPIO_B0_11) U2.B2(GPIO_EMC_18) U2.B3(GPIO_EMC_26) U2.B4(GPIO_EMC_19) U2.B6(GPIO_EMC_14) U2.B7(GPIO_EMC_39) U2.B8(GPIO_B0_05) U2.B9(GPIO_B0_08) U2.C1(GPIO_EMC_21) U2.C2(GPIO_EMC_09) U2.C4(GPIO_EMC_33) U2.C5(GPIO_EMC_31) U2.C6(GPIO_EMC_30) U2.C7(GPIO_EMC_41) U2.D1(GPIO_EMC_28) U2.D2(GPIO_EMC_25) U2.D3(GPIO_EMC_24) U2.D4(GPIO_EMC_34) U2.D5(GPIO_EMC_32) U2.E1(GPIO_EMC_29) U2.F4(GPIO_EMC_02) U2.G1(GPIO_EMC_10) U2.G2(GPIO_EMC_23) U2.G3(GPIO_EMC_11) U2.G4(GPIO_EMC_03) U2.G12(GPIO_AD_B1_14) U2.H3(GPIO_EMC_08) U2.H4(GPIO_EMC_07) U2.H5(GPIO_EMC_06) U2.H10(GPIO_AD_B0_01) U2.H11(GPIO_AD_B1_13) U2.H12(GPIO_AD_B1_12) U2.H13(GPIO_AD_B1_08) U2.H14(GPIO_AD_B0_14) U2.J11(GPIO_AD_B1_00) U2.J12(GPIO_AD_B1_06) U2.J13(GPIO_AD_B1_11) U2.J14(GPIO_AD_B1_15) U2.K10(GPIO_AD_B1_07) U2.K11(GPIO_AD_B1_01) U2.K14(GPIO_AD_B0_12) U2.L5(GPIO_SD_B1_00) U2.L10(GPIO_AD_B0_15) U2.L11(GPIO_AD_B1_02) U2.L12(GPIO_AD_B1_04) U2.L13(GPIO_AD_B1_10) U2.L14(GPIO_AD_B0_13) U2.M3(GPIO_SD_B1_02) U2.M4(GPIO_SD_B1_03) U2.M12(GPIO_AD_B1_03) U2.M13(GPIO_AD_B1_09) U2.N3(GPIO_SD_B1_05) U2.P2(GPIO_SD_B1_04)
BOOT_MODE0: H25.1 R8.1 U2.G14(GPIO_AD_B0_05)
BOOT_MODE1: H26.1 R9.2 U2.F11(GPIO_AD_B0_04)
CCM_CLK1_N: H7.20 U2.P13(CCM_CLK1_N)
CCM_CLK1_P: H7.18 U2.N13(CCM_CLK1_P)
ENC1A: R42.2 U2.B1(GPIO_EMC_15) U81.3
ENC1B: R43.2 U2.A5(GPIO_EMC_16) U81.4
ENC2A: R41.2 U2.F2(GPIO_EMC_04) U79.3
ENC2B: R44.2 U2.C3(GPIO_EMC_36) U79.4
ENC3A: R40.2 U2.E4(GPIO_EMC_37) U80.3
ENC3B: R45.2 U2.E5(GPIO_EMC_35) U80.4
ETH-LED1: R17.2 U17.4(LED0)
ETH-LED2: R16.2 U17.2(50MHzOut/LED2)
ETH-M-RD_N: C54.2 U17.7(RD_M)
ETH-M-RD_P: C52.2 U17.8(RD_P)
ETH-M-TD_N: C51.2 U17.10(TD_M)
ETH-M-TD_P: C53.2 U17.11(TD_P)
ETH-MX-RD_N: C54.1 RJ1.6
ETH-MX-RD_P: C52.1 RJ1.3
ETH-MX-TD_N: C51.1 RJ1.2
ETH-MX-TD_P: C53.1 RJ1.1
ETH_CRS_DV: U2.C12(GPIO_B1_06) U17.20(CRS_DV)
ETH_INTR: U2.E11(GPIO_B0_15) U17.3(INTR/PWRDN)
ETH_MDC: U2.C14(GPIO_B1_14) U17.16(MDC)
ETH_MDIO: U2.B14(GPIO_B1_15) U17.15(MDIO)
ETH_RST_N: U2.E10(GPIO_B0_14) U17.5(RST_N)
ETH_RX_D0: U2.E12(GPIO_B1_04) U17.18(RX_D0)
ETH_RX_D1: U2.D12(GPIO_B1_05) U17.17(RX_D1)
ETH_RX_ER: U2.C13(GPIO_B1_11) U17.22(RX_ER)
ETH_TX_D0: U2.B12(GPIO_B1_07) U17.23(TX_D0)
ETH_TX_D1: U2.A12(GPIO_B1_08) U17.24(TX_D1)
ETH_TX_EN: U2.A13(GPIO_B1_09) U17.1(TX_EN)
ETH_XI: U2.B13(GPIO_B1_10) U17.13(XI/50MHzin)
M1-HALL-A: R57.1 U2.E7(GPIO_B0_01)
M1-HALL-B: R61.1 U2.E8(GPIO_B0_02)
M1-HALL-C: R59.1 U2.D14(GPIO_B1_13)
M2-HALL-A: R63.1 U2.D13(GPIO_B1_12)
M2-HALL-B: R67.1 U2.D8(GPIO_B0_03)
M2-HALL-C: R65.1 U2.D9(GPIO_B0_10)
M3-HALL-A: R69.1 U2.C11(GPIO_B1_02)
M3-HALL-B: R73.1 U2.C9(GPIO_B0_09)
M3-HALL-C: R71.1 U2.C10(GPIO_B0_12)
ONOFF: H28.1 U2.M6(ONOFF)
PMIC_ON_REQ: R1.1 U2.K7(PMIC_ON_REQ) U23.3(EN)
POR_B: C32.1 R29.2 SW1.2(B) U2.M7(POR_B)
SD-CLK: R91.1 U18.5(CLK)
SD-CLK-RT: R91.2 U2.J3(GPIO_SD_B0_01)
SD-CMD: R26.1 U2.J4(GPIO_SD_B0_00) U18.3(CMD)
SD-DAT0: R27.1 U2.J1(GPIO_SD_B0_02) U18.7(DAT0)
SD-DAT1: R28.1 U2.K1(GPIO_SD_B0_03) U18.8(DAT1)
SD-DAT2: R18.1 U2.H2(GPIO_SD_B0_04) U18.1(DAT2)
SD-DAT3: R25.1 U2.J2(GPIO_SD_B0_05) U18.2(CD/DAT3)
SD_B1_01: H28.2 U2.M5(GPIO_SD_B1_01)
SD_B1_06: U2.L3(GPIO_SD_B1_06) U19.1(CS#)
SD_B1_07: R126.1 U19.6(CLK)
SD_B1_08: U2.P3(GPIO_SD_B1_08) U19.5(DI(IO0))
SD_B1_09: U2.N4(GPIO_SD_B1_09) U19.2(DO(IO1))
SD_B1_10: U2.P4(GPIO_SD_B1_10) U19.3(IO2)
SD_B1_11: U2.P5(GPIO_SD_B1_11) U19.7(IO3)
SPARE_IO-1_AD: H7.5 U2.K12(GPIO_AD_B1_05)
UART_RX1: U2.G11(GPIO_AD_B0_03) U82.2
UART_TX1: U2.M11(GPIO_AD_B0_02) U82.4
USB_D+: U2.L8(USB_OTG1_DP) USB1.3(D+)
USB_D-: U2.M8(USB_OTG1_DN) USB1.2(D-)
USB_VBUS+5V_EXT: C27.2 H24.2 USB1.1(VBUS)
USB_VBUS+5V_INT: U2.N6(USB_OTG1_VBUS)
$1N3321: H24.1 L9.1
$1N5282: C31.2 U2.M10(VDD_SNVS_CAP)
$1N5709: R2.1 U18.9(CARD_DETECT)
$1N7252: C29.2 U2.K8(VDD_USB_CAP)
$1N9248: C34.1 U2.N11(XTALO) X4.1
$1N9253: C35.1 R11.1 U2.P11(XTALI) X4.2
$1N9641: C2.1 U2.P9(RTC_XTALO) U66.2(GND)
$1N9645: C1.1 U2.N9(RTC_XTALI) U66.1
$1N14387: R12.2 U2.K3(DCDC_PSWITCH)
$1N14683: C36.2 C37.2 U2.P10(NVCC_PLL)
$1N14841: C38.2 C39.2 U2.P8(VDD_HIGH_CAP)
$1N15470: L4.1 U2.M1(DCDC_LP) U2.M2(DCDC_LP)
$1N15653: C44.1 C45.1 C46.1 C47.1 L8.1 U2.L1(DCDC_IN) U2.L2(DCDC_IN)
$1N17011: R13.2 U17.14(RBIAS)
$1N19713: R17.1 RJ1.11(R-)
$1N23826: C64.2 L11.1 U95.6(SW)
$1N27405: L9.2 U77.2
$1N27515: C71.2 L7.1 U95.4(EN) U95.5(VIN)
$1N29938: D4.2(A) U47.1 U83.2
$1N33418: R19.2 R22.1 U95.3(FB)
$1N33422: R21.1 R22.2
$1N42129: Q1.3(D) U77.1
$1N42286: R16.1 RJ1.9(L-)
$1N69624: H4.3 R56.1 R57.2
$1N69828: H4.5 R58.1 R59.2
$1N70032: H4.4 R60.1 R61.2
$1N70382: H5.5 R64.1 R65.2
$1N70388: H5.3 R62.1 R63.2
$1N70395: H5.4 R66.1 R67.2
$1N70758: H6.5 R70.1 R71.2
$1N70764: H6.3 R68.1 R69.2
$1N70771: H6.4 R72.1 R73.2
$1N70888: D4.1(K) U84.1
$1N70894: C58.2 L7.2 U84.2
$1N154598: R80.1 U2.M14(GPIO_AD_B0_00)
$1N154686: R81.1 U2.E3(GPIO_EMC_00)
$1N158737: C64.1 U95.1(CB)
$1N166542: LED3.2(A) R95.1
$1N166581: LED1.2(A) R96.1
$1N182079: R126.2 U2.L4(GPIO_SD_B1_07)

Not connected (* = marked no-connect by the designer): H4 6; H5 6; H6 6; RJ1 4 5 7 8; SW1 1(A) 3(C); U2 A11(GPIO_B1_00) B11(GPIO_B1_01)* C8(GPIO_B0_04)* D6(GPIO_EMC_38)* D7(GPIO_B0_00)* D10(GPIO_B0_13)* D11(GPIO_B1_03)* E14(GPIO_AD_B0_06)* F1(GPIO_EMC_22)* F3(GPIO_EMC_01)* F12(GPIO_AD_B0_07)* F13(GPIO_AD_B0_08)* F14(GPIO_AD_B0_09)* G5(GPIO_EMC_05)* G10(GPIO_AD_B0_11)* G13(GPIO_AD_B0_10)* H1(GPIO_EMC_12)* L6(WAKEUP)* L7(PMIC_STBY_REQ)* N7(USB_OTG2_DN)* N10(GPANAIO)* N12(USB_OTG1_CHD_B)* P7(USB_OTG2_DP)*; U17 12(XO)*; U19 9(EP)*; U23 2(GND) 4(NC); USB1 4(ID)

## Notes on the sheet
- 3x3Motor
- V2.0
- 3x3MotorFPGA
- Open Source 18-36V 3x motor controller board.
- Designed by: Olle Welin 2025
- BOOT_MODE0
- 36VDC power supply
- External Motor bus power switch
- and in serial with an
- external 30A fuse.
- BOOT_MODE1
- USB 5V POWER
- HALL-M1
- HALL-M2
- HALL-M3
- SPARE
